# EAGLE design LED (EAGLE 8.6.3)
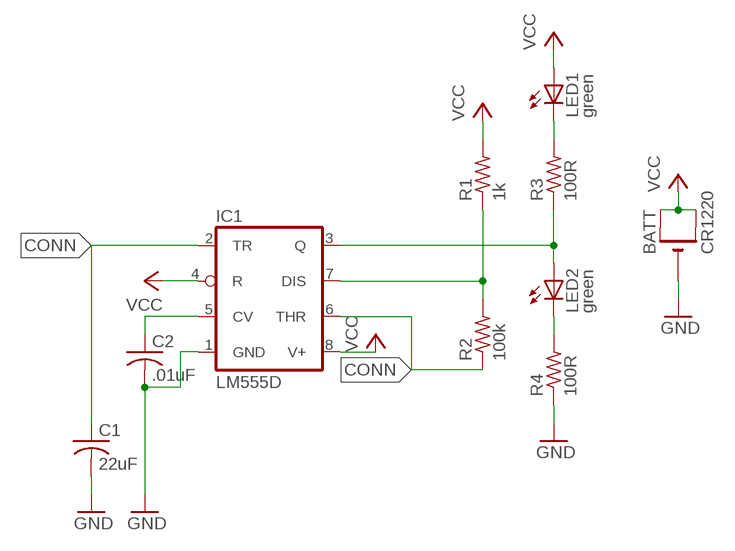
[diagram p0: schematic, sheet 1]

## Parts
BATT  CR1220  CR1220SMT  [CR1220-SMD]
C1  22uF  C-USC0805  [C0805]
C2  .01uF  C-USC0805  [C0805]
IC1  LM555D  [SO08]
LED1  green  LEDCHIPLED_0805  [CHIPLED_0805]
LED2  green  LEDCHIPLED_0805  [CHIPLED_0805]
R1  1k  R-US_R0805  [R0805]
R2  100k  R-US_R0805  [R0805]
R3  100R  R-US_R0805  [R0805]
R4  100R  R-US_R0805  [R0805]

## Nets
CONN: C1.1 IC1.2(TR) IC1.6(THR) R2.1
GND: BATT.- C1.2 C2.2 IC1.1(GND) R4.1
N$3: C2.1 IC1.5(CV)
N$4: IC1.7(DIS) R1.1 R2.2
N$6: LED1.C R3.2
N$7: IC1.3(Q) LED2.A R3.1
N$8: LED2.C R4.2
VCC: BATT.+$1(+) BATT.+$2(+1) IC1.4(R) IC1.8(V+) LED1.A R1.2

## Library data of the parts
BATT = adafruit:CR1220: CR1216/CR1220/CR1225 12mm 3V lithium coin cell Great for battery packup. Both SMT and THM holders. Note the THM package has the ground pads on both sides of the PCB so that the masks are the same - this reduces the cost
C1 = adafruit:C-US: CAPACITOR, American symbol; SPICEPREFIX: C
C2 = adafruit:C-US: CAPACITOR, American symbol
IC1 = adafruit:*555: TIMER Changed DIP package to have round (not oval) pin pads http://www.ladyada.net/library/pcb/eaglelibrary.html; SPICEPREFIX: X
LED1 LED2 = adafruit:LED: LED OSRAM: - CHIPLED LG R971, LG N971, LY N971, LG Q971, LY Q971, LO R971, LY R971 LH N974, LH R974 LS Q976, LO Q976, LY Q976 LO Q996 - Hyper CHIPLED LW Q18S LB Q993, LB Q99A, LB R99A - SideLED LS A670, LO A670, LY A670, LG A670, LP A670 LB A673, LV A673, LT A673, LW A673 LH A674 LY A675 LS A676, LA A676, LO A676, LY A676, LW A676 LS A679, LY A679, LG A679 - Hyper Micro SIDELED® LS Y876, LA Y876, LO Y876, LY Y876 LT Y87S - SmartLED LW L88C, LW L88S LB L89C, LB L89S, LG L890 LS L89K, LO L89K, LY L89K LS L896, LA L896, LO L896, LY L896 - TOPLED LS T670, LO T670, LY T670, LG T670, LP T670 LSG T670, LSP T670, LSY T670, LOP T670, LYG T670 LG T671, LOG T671, LSG T671 LB T673, LV T673, LT T673, LW T673 LH T674 LS T676, LA T676, LO T676, LY T676, LB T676, LH T676, LSB T676, LW T676 LB T67C, LV T67C, LT T67C, LS T67K, LO T67K, LY T67K, LW E67C LS E67B, LA E67B, LO E67B, LY E67B, LB E67C, LV E67C, LT E67C LW T67C LS T679, LY T679, LG T679 LS T770, LO T770, LY T770, LG T770, LP T770 LB T773, LV T773, LT T773, LW T773 LH T774 LS E675, LA E675, LY E675, LS T675 LS T776, LA T776, LO T776, LY T776, LB T776 LHGB T686 LT T68C, LB T68C - Hyper Mini TOPLED® LB M676 - Mini TOPLED Santana® LG M470 LS M47K, LO M47K, LY M47K Source: http://www.osram.convergy.de/
R1-R4 = adafruit:R-US_: RESISTOR, American symbol

## Net classes
0 default: width 0.305 mm, drill 0.508 mm, clearance 0.254 mm

## Board
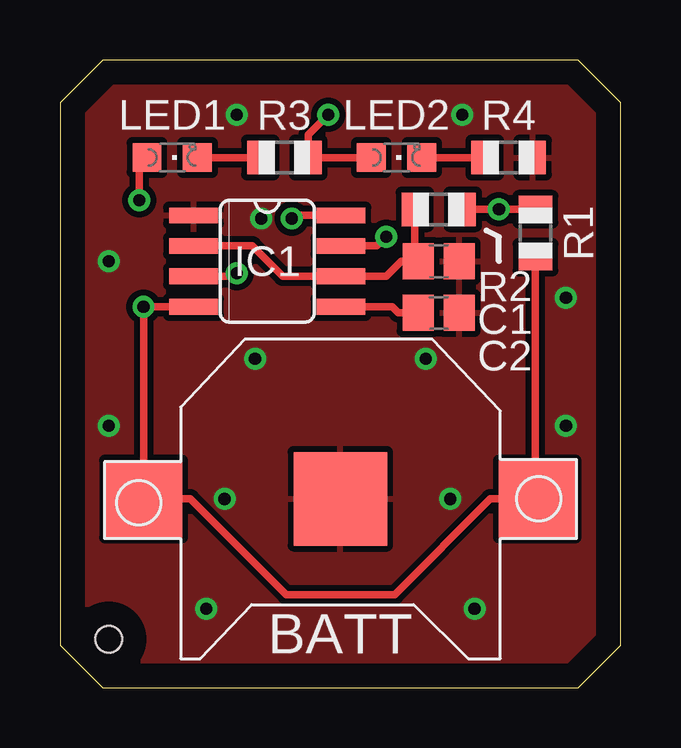
[diagram p1: board, top side]
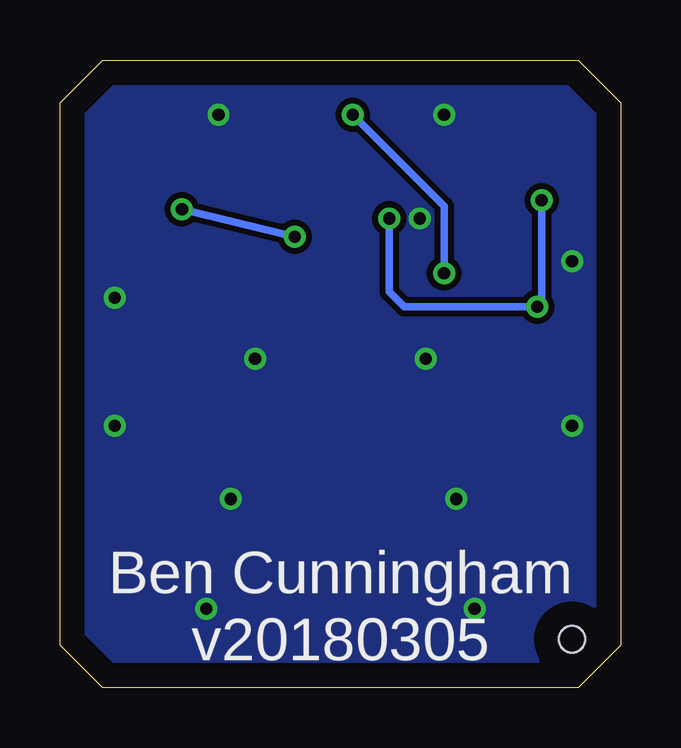
[diagram p2: board, bottom side, seen from below]

Size 23.37 x 26.16 mm. Coordinates in mm from the lower left corner, seen from the top.
Outline: 0,24.38 0,1.78 1.78,0 21.59,0 23.37,1.78 23.37,24.38 21.59,26.16 1.78,26.16 0,24.38
Copper layers (1*16): Top 0.035mm / dielectric 1.5mm / Bottom 0.035mm
Design rules "LED *": minimum track width 6mil, minimum drill 0.35mm, track to track 0.205mm, track to pad 0.205mm, pad to pad 0.205mm, via to via 0.205mm, smd to smd 6mil, copper to edge 40mil, drill to drill 6mil, minimum pad ring 10mil, minimum via ring 8mil, stop-mask expansion 4mil, vias tented up to drill 0mil, thermal gap 10mil
Holes 1.1 mm at 2.03,2.03

### Footprints (pad centres in the part's own frame; a part is rotated, then mirrored left to right if it is on the bottom)
CR1220-SMD = smd 3.2 x 3.2: +$1 -8.2,0; +$2 8.2,0 | smd 3.9 x 3.9: - 0,0
C0805 = smd 1.3 x 1.5: 1 -0.85,0; 2 0.85,0
SO08 = smd 0.66 x 2.032: 1 -1.905,-3.073; 2 -0.635,-3.073; 3 0.635,-3.073; 4 1.905,-3.073; 5 1.905,3.073; 6 0.635,3.073; 7 -0.635,3.073; 8 -1.905,3.073
CHIPLED_0805 = smd 1.2 x 1.2: A 0,-1.05; C 0,1.05
R0805 = smd 1.1 x 1.4: 1 -1,0; 2 1,0

### Placement (x,y rotation side)
BATT  11.68,7.87 180 top
C1  15.78,17.78 0 top
C2  15.78,15.62 0 top
IC1  8.64,17.78 270 top
LED1  4.67,22.1 270 top
LED2  14.02,22.1 270 top
R1  19.81,18.95 270 top
R2  15.78,19.94 0 top
R3  9.35,22.1 180 top
R4  18.69,22.1 180 top

### Tracks (layer width: path | path; a pad name or v marks a point on that pad's centre or on a via)
CONN
  Top 0.305: IC1.2 8,18.41 9.27,17.14 IC1.6 13.59,17.14 14.22,17.78 C1.1 14.78,17.93 R2.1
GND  (via drill 0.51)
  other vias: 21.08,10.92 2.03,17.78 21.08,16.26 7.37,23.88 6.1,3.3 17.27,3.3 16.26,7.87 6.86,7.87 16.76,23.88 2.03,10.92 15.24,13.72 8.13,13.72 8.38,19.56
  pour Top: -0.13,-0.13 -0.13,26.29 23.37,26.29 23.62,-0.13
  pour Bottom: -0.13,-0.13 -0.13,26.29 23.37,26.29 23.62,-0.13
N$3
  Top 0.305: IC1.5 13.84,15.88 14.1,15.62 C2.1
N$4  (via drill 0.51)
  Top 0.305: R1.1 v18.3,19.95 v18.29,19.94 R2.2 | v13.59,18.8 13.21,18.41 IC1.7
  Bottom 0.305: v18.29,19.94 v13.59,18.8
N$6
  Top 0.305: R3.2 LED1.C
N$7  (via drill 0.51)
  Top 0.305: IC1.3 7.24,17.14 v7.37,17.27 | LED2.A R3.1 10.35,23.05 v11.18,23.88
  Bottom 0.305: v11.18,23.88 7.37,20.07 v7.37,17.27
N$8
  Top 0.305: R4.2 LED2.C
VCC  (via drill 0.51)
  Top 0.305: IC1.4 v3.48,15.88 BATT.+$2 5.43,7.87 9.43,3.88 13.94,3.88 17.94,7.87 BATT.+$1 19.81,7.95 R1.2 | IC1.8 9.78,19.68 v9.65,19.56 | v3.3,20.32 3.3,21.78 LED1.A
  Bottom 0.305: v9.65,19.56 9.65,16.51 9.02,15.88 3.56,15.88 | v3.3,20.32 3.3,16.13 3.56,15.88 | v3.48,15.88 3.56,15.88

### Text on the board
bPlace: Ben Cunningham | v20180305